# Altium project pic.PrjPcb
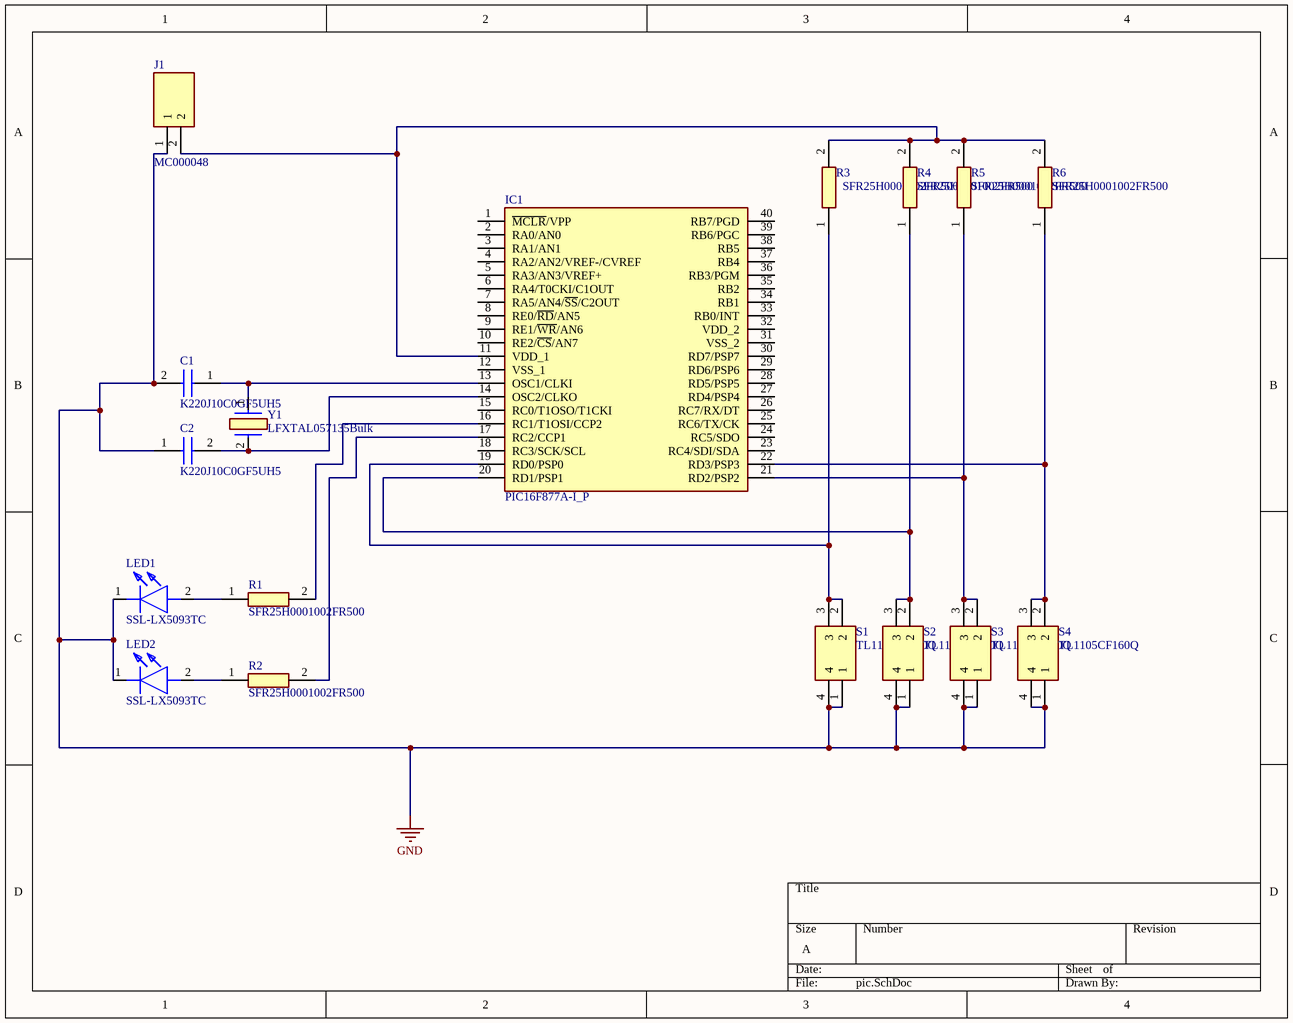
[diagram p0: pic.SchDoc]
1 sheet, 17 parts. Net scope: global (net labels, ports and power ports of the same name join across sheets).
Board file: pcb.PcbDoc

## Sheet pic.SchDoc
size A; SheetNumber: 1; SheetTotal: 1

### Parts
C1  K220J10C0GF5UH5  [K220J10C0GF5UH5]
C2  K220J10C0GF5UH5  [K220J10C0GF5UH5]
IC1  PIC16F877A-I_P  [DIP1550W56P254L5219H483Q40N]
J1  MC000048  [MC000048]
LED1  SSL-LX5093TC  [SSL-LX5093SGC/B]
LED2  SSL-LX5093TC  [SSL-LX5093SGC/B]
R1  SFR25H0001002FR500  [RESAD1750W63L750D250]
R2  SFR25H0001002FR500  [RESAD1750W63L750D250]
R3  SFR25H0001002FR500  [RESAD1750W63L750D250]
R4  SFR25H0001002FR500  [RESAD1750W63L750D250]
R5  SFR25H0001002FR500  [RESAD1750W63L750D250]
R6  SFR25H0001002FR500  [RESAD1750W63L750D250]
S1  TL1105CF160Q  [TL1105CF160Q]
S2  TL1105CF160Q  [TL1105CF160Q]
S3  TL1105CF160Q  [TL1105CF160Q]
S4  TL1105CF160Q  [TL1105CF160Q]
Y1  LFXTAL057135Bulk  [LFXTAL057135Bulk]

### Nets
GND: C1.2 C2.1 J1.1 LED1.1(K) LED2.1(K) S1.1 S1.4 S2.1 S2.4 S3.1 S3.4 S4.1 S4.4
NetC1_1: C1.1 IC1.13(OSC1/CLKI) Y1.1
NetC2_2: C2.2 IC1.14(OSC2/CLKO) Y1.2
NetIC1_11: IC1.11(VDD_1) J1.2 R3.2 R4.2 R5.2 R6.2
NetIC1_16: IC1.16(RC1/T1OSI/CCP2) R1.2
NetIC1_17: IC1.17(RC2/CCP1) R2.2
NetIC1_19: IC1.19(RD0/PSP0) R3.1 S1.2 S1.3
NetIC1_20: IC1.20(RD1/PSP1) R4.1 S2.2 S2.3
NetIC1_21: IC1.21(RD2/PSP2) R5.1 S3.2 S3.3
NetIC1_22: IC1.22(RD3/PSP3) R6.1 S4.2 S4.3
NetLED1_2: LED1.2(A) R1.1
NetLED2_2: LED2.2(A) R2.1

Not connected (* = marked no-connect by the designer): IC1 1(~{MCLR}/VPP) 2(RA0/AN0) 3(RA1/AN1) 4(RA2/AN2/VREF-/CVREF) 5(RA3/AN3/VREF+) 6(RA4/T0CKI/C1OUT) 7(RA5/AN4/~{SS}/C2OUT) 8(RE0/~{RD}/AN5) 9(RE1/~{WR}/AN6) 10(RE2/~{CS}/AN7) 12(VSS_1) 15(RC0/T1OSO/T1CKI) 18(RC3/SCK/SCL) 23(RC4/SDI/SDA) 24(RC5/SDO) 25(RC6/TX/CK) 26(RC7/RX/DT) 27(RD4/PSP4) 28(RD5/PSP5) 29(RD6/PSP6) 30(RD7/PSP7) 31(VSS_2) 32(VDD_2) 33(RB0/INT) 34(RB1) 35(RB2) 36(RB3/PGM) 37(RB4) 38(RB5) 39(RB6/PGC) 40(RB7/PGD)

### Library data of the parts
C1 C2 = K220J10C0GF5UH5: Capacitor; Manufacturer_Name: Vishay; Datasheet Link: https://componentsearchengine.com/Datasheets/1/K220J10C0GF5UH5.pdf; Height: 6.2mm; Manufacturer_Part_Number: K220J10C0GF5UH5; Mouser Part Number: 594-K220J10C0GF5UH5; Mouser Price/Stock: https://www.mouser.co.uk/ProductDetail/Vishay-BC-Components/K220J10C0GF5UH5?qs=urQb6HxmPnJQavwMwFUEEw%3D%3D; Arrow Part Number: K220J10C0GF5UH5; Arrow Price/Stock: https://www.arrow.com/en/products/k220j10c0gf5uh5/vishay
IC1 = PIC16F877A-I_P: Integrated Circuit; Manufacturer_Name: Microchip; Manufacturer_Part_Number: PIC16F877A-I/P; Datasheet Link: http://componentsearchengine.com/Datasheets/1/PIC16F877A-I_P.pdf; Height: 4.83mm; Mouser Part Number: 579-PIC16F877A-I/P; Mouser Price/Stock: https://www.mouser.co.uk/ProductDetail/Microchip-Technology-Atmel/PIC16F877A-I-P?qs=Vn0zuzr35GH%252Bfm6E5Siyuw%3D%3D; Arrow Part Number: PIC16F877A-I/P; Arrow Price/Stock: https://www.arrow.com/en/products/pic16f877a-ip/microchip-technology?region=nac
J1 = MC000048: Connector; Manufacturer_Name: MULTICOMP; Datasheet Link: http://www.farnell.com/datasheets/3186341.pdf; Height: 14.3mm; Manufacturer_Part_Number: MC000048
LED1 LED2 = SSL-LX5093TC: LED; Manufacturer_Name: Lumex; Datasheet Link: https://datasheet.datasheetarchive.com/originals/distributors/Datasheets-DGA13/1155111.pdf; Manufacturer_Part_Number: SSL-LX5093TC; Mouser Part Number: 696-SSL-LX5093TC; Mouser Price/Stock: https://www.mouser.co.uk/ProductDetail/Lumex/SSL-LX5093TC?qs=94qWIstW55WGdi06hcoEWQ%3D%3D; Arrow Part Number: SSL-LX5093TC; Arrow Price/Stock: https://www.arrow.com/en/products/ssl-lx5093tc/lumex?region=nac
R1-R6 = SFR25H0001002FR500: Resistor; Manufacturer_Name: Vishay; Datasheet Link: https://www.arrow.com/en/products/sfr25h0001002fr500/vishay; Manufacturer_Part_Number: SFR25H0001002FR500; Mouser Part Number: 594-5053HD10K00F; Mouser Price/Stock: https://www.mouser.co.uk/ProductDetail/Vishay-BC-Components/SFR25H0001002FR500?qs=LCMWAU1DZcweHnnyAMZ4Zg%3D%3D; Arrow Part Number: SFR25H0001002FR500; Arrow Price/Stock: https://www.arrow.com/en/products/sfr25h0001002fr500/vishay?region=nac
S1-S4 = TL1105CF160Q: Switch; Manufacturer_Name: E-Switch; Datasheet Link: https://componentsearchengine.com/Datasheets/1/TL1105CF160Q.pdf; Height: 8mm; Manufacturer_Part_Number: TL1105CF160Q; Mouser Part Number: 612-TL1105C; Mouser Price/Stock: https://www.mouser.co.uk/ProductDetail/E-Switch/TL1105CF160Q?qs=YXf4ACKMM4yAAz%252BbnhourA%3D%3D
Y1 = LFXTAL057135Bulk: Crystal or Oscillator; Manufacturer_Name: IQD; Datasheet Link: https://componentsearchengine.com/Datasheets/1/LFXTAL057135Bulk.pdf; Height: 4.1mm; Manufacturer_Part_Number: LFXTAL057135Bulk; Mouser Part Number: 449-LFXTAL057135BULK; Mouser Price/Stock: https://www.mouser.co.uk/ProductDetail/IQD/LFXTAL057135Bulk?qs=e4%2FAndAAwgIkCKEhU7u90A%3D%3D